# Altium schematic sheet main_control_board.SchDoc
size A4
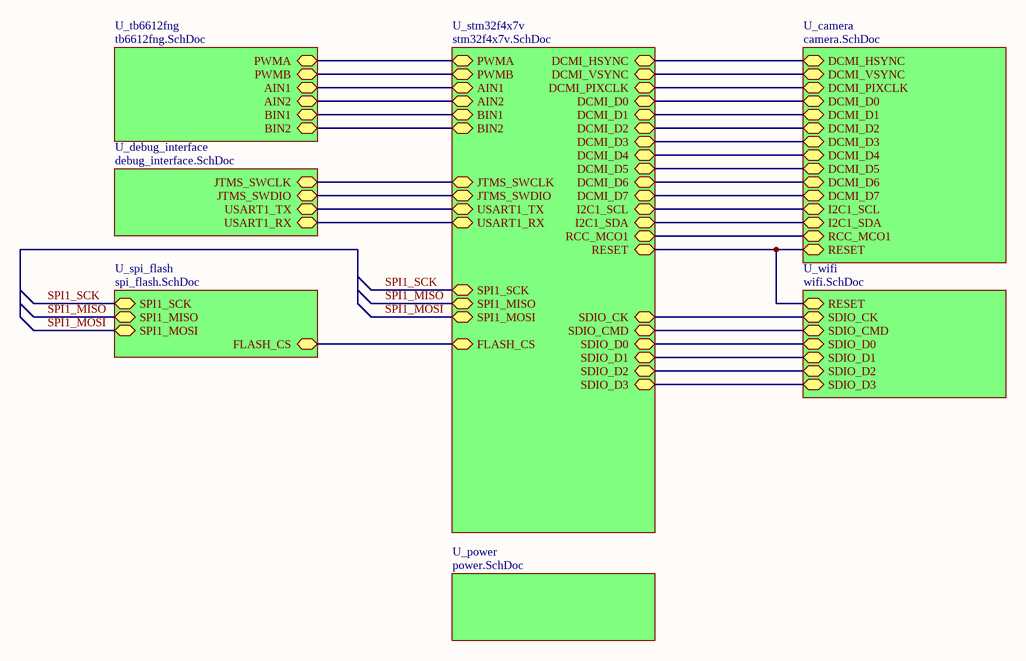
[diagram p0: main_control_board.SchDoc]

## Sub-sheets
U_camera = camera.SchDoc: DCMI_VSYNC (bidir), DCMI_HSYNC (bidir), RESET (bidir), DCMI_D1 (bidir), DCMI_D3 (bidir), DCMI_D5 (bidir), DCMI_D7 (bidir), RCC_MCO1 (bidir), I2C1_SCL (bidir), I2C1_SDA (bidir), DCMI_D6 (bidir), DCMI_D4 (bidir), DCMI_D2 (bidir), DCMI_D0 (bidir), DCMI_PIXCLK (bidir)
U_debug_interface = debug_interface.SchDoc: USART1_RX (bidir), USART1_TX (bidir), JTMS_SWCLK (bidir), JTMS_SWDIO (bidir)
U_power = power.SchDoc: no entries
U_spi_flash = spi_flash.SchDoc: SPI1_SCK (bidir), SPI1_MOSI (bidir), SPI1_MISO (bidir), FLASH_CS (bidir)
U_stm32f4x7v = stm32f4x7v.SchDoc: DCMI_HSYNC (bidir), DCMI_VSYNC (bidir), RESET (bidir), DCMI_D1 (bidir), DCMI_D3 (bidir), DCMI_D5 (bidir), DCMI_D7 (bidir), RCC_MCO1 (bidir), I2C1_SCL (bidir), I2C1_SDA (bidir), DCMI_D6 (bidir), DCMI_D4 (bidir), DCMI_D2 (bidir), DCMI_D0 (bidir), DCMI_PIXCLK (bidir), USART1_RX (bidir), USART1_TX (bidir), JTMS_SWCLK (bidir), JTMS_SWDIO (bidir), SDIO_D2 (bidir), SDIO_D1 (bidir), SDIO_CK (bidir), SDIO_CMD (bidir), SDIO_D3 (bidir), SDIO_D0 (bidir), PWMA (bidir), AIN2 (bidir), AIN1 (bidir), BIN1 (bidir), BIN2 (bidir), PWMB (bidir), SPI1_SCK (bidir), SPI1_MOSI (bidir), SPI1_MISO (bidir), FLASH_CS (bidir)
U_tb6612fng = tb6612fng.SchDoc: PWMA (bidir), AIN2 (bidir), AIN1 (bidir), BIN1 (bidir), BIN2 (bidir), PWMB (bidir)
U_wifi = wifi.SchDoc: SDIO_D2 (bidir), SDIO_D1 (bidir), SDIO_CK (bidir), SDIO_CMD (bidir), SDIO_D3 (bidir), SDIO_D0 (bidir), RESET (bidir)

## Nets
SPI1_MISO: sheet U_stm32f4x7v/SPI1_MISO, sheet U_spi_flash/SPI1_MISO
SPI1_MOSI: sheet U_stm32f4x7v/SPI1_MOSI, sheet U_spi_flash/SPI1_MOSI
SPI1_SCK: sheet U_stm32f4x7v/SPI1_SCK, sheet U_spi_flash/SPI1_SCK
(unnamed): sheet U_stm32f4x7v/DCMI_HSYNC, sheet U_camera/DCMI_HSYNC
(unnamed): sheet U_stm32f4x7v/DCMI_VSYNC, sheet U_camera/DCMI_VSYNC
(unnamed): sheet U_stm32f4x7v/RESET, sheet U_wifi/RESET, sheet U_camera/RESET
(unnamed): sheet U_stm32f4x7v/DCMI_D1, sheet U_camera/DCMI_D1
(unnamed): sheet U_stm32f4x7v/DCMI_D3, sheet U_camera/DCMI_D3
(unnamed): sheet U_stm32f4x7v/DCMI_D5, sheet U_camera/DCMI_D5
(unnamed): sheet U_stm32f4x7v/DCMI_D7, sheet U_camera/DCMI_D7
(unnamed): sheet U_stm32f4x7v/RCC_MCO1, sheet U_camera/RCC_MCO1
(unnamed): sheet U_stm32f4x7v/I2C1_SCL, sheet U_camera/I2C1_SCL
(unnamed): sheet U_stm32f4x7v/I2C1_SDA, sheet U_camera/I2C1_SDA
(unnamed): sheet U_stm32f4x7v/DCMI_D6, sheet U_camera/DCMI_D6
(unnamed): sheet U_stm32f4x7v/DCMI_D4, sheet U_camera/DCMI_D4
(unnamed): sheet U_stm32f4x7v/DCMI_D2, sheet U_camera/DCMI_D2
(unnamed): sheet U_stm32f4x7v/DCMI_D0, sheet U_camera/DCMI_D0
(unnamed): sheet U_stm32f4x7v/DCMI_PIXCLK, sheet U_camera/DCMI_PIXCLK
(unnamed): sheet U_stm32f4x7v/USART1_RX, sheet U_debug_interface/USART1_RX
(unnamed): sheet U_stm32f4x7v/USART1_TX, sheet U_debug_interface/USART1_TX
(unnamed): sheet U_stm32f4x7v/JTMS_SWCLK, sheet U_debug_interface/JTMS_SWCLK
(unnamed): sheet U_stm32f4x7v/JTMS_SWDIO, sheet U_debug_interface/JTMS_SWDIO
(unnamed): sheet U_stm32f4x7v/SDIO_D2, sheet U_wifi/SDIO_D2
(unnamed): sheet U_stm32f4x7v/SDIO_D1, sheet U_wifi/SDIO_D1
(unnamed): sheet U_stm32f4x7v/SDIO_CK, sheet U_wifi/SDIO_CK
(unnamed): sheet U_stm32f4x7v/SDIO_CMD, sheet U_wifi/SDIO_CMD
(unnamed): sheet U_stm32f4x7v/SDIO_D3, sheet U_wifi/SDIO_D3
(unnamed): sheet U_stm32f4x7v/SDIO_D0, sheet U_wifi/SDIO_D0
(unnamed): sheet U_stm32f4x7v/PWMA, sheet U_tb6612fng/PWMA
(unnamed): sheet U_stm32f4x7v/AIN2, sheet U_tb6612fng/AIN2
(unnamed): sheet U_stm32f4x7v/AIN1, sheet U_tb6612fng/AIN1
(unnamed): sheet U_stm32f4x7v/BIN1, sheet U_tb6612fng/BIN1
(unnamed): sheet U_stm32f4x7v/BIN2, sheet U_tb6612fng/BIN2
(unnamed): sheet U_stm32f4x7v/PWMB, sheet U_tb6612fng/PWMB
(unnamed): sheet U_stm32f4x7v/FLASH_CS, sheet U_spi_flash/FLASH_CS